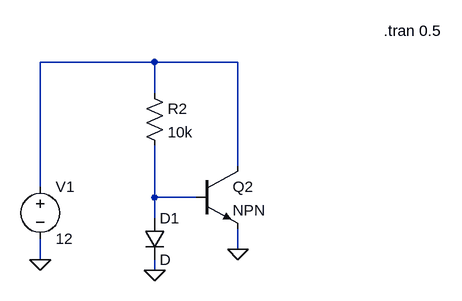
[diagram p0: schematic Draft5.asc]
Draft5.asc, the LTspice schematic file:
Version 4
SHEET 1 880 704
WIRE 288 240 112 240
WIRE 416 240 288 240
WIRE 288 288 288 240
WIRE 416 400 416 240
WIRE 112 432 112 240
WIRE 288 448 288 368
WIRE 352 448 288 448
WIRE 288 480 288 448
WIRE 416 528 416 496
WIRE 112 544 112 512
WIRE 288 560 288 544
FLAG 112 544 0
FLAG 288 560 0
FLAG 416 528 0
SYMBOL Diode 272 480 R0
SYMATTR InstName D1
SYMBOL Res 272 272 R0
SYMATTR InstName R2
SYMATTR Value 10k
SYMBOL Voltage 112 416 R0
SYMATTR InstName V1
SYMATTR Value 12
SYMBOL npn 352 400 R0
SYMATTR InstName Q2
TEXT 640 192 Left 2 !.tran 0.5

The netlist it stands for:
* Draft5.asc
D1 N002 0 D
R2 N001 N002 10k
V1 N001 0 12
Q2 N001 N002 0 0 NPN
.model D D
.lib standard.dio
.model NPN NPN
.model PNP PNP
.lib standard.bjt
.tran 0.5
.backanno
.end